# Altium schematic sheet audio_tas5720_amplifier.SchDoc
size A
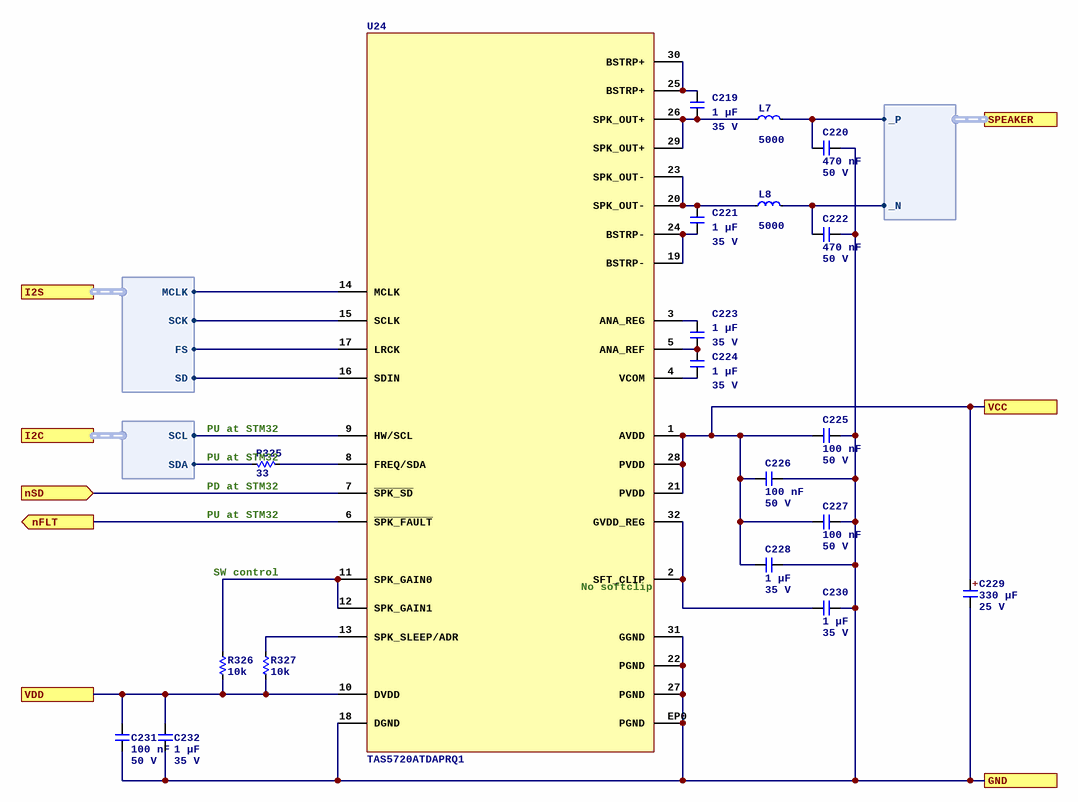
[diagram p0: audio_tas5720_amplifier.SchDoc]

## Parts
C219  Capacitance: 1 µF  Voltage Rating: 35 V  [C0603]  (hidden comment: GMK107AB7105KAHT)
C220  Capacitance: 470 nF  Voltage Rating: 50 V  [C0603]  (hidden comment: CC0603KRX7R9BB474)
C221  Capacitance: 1 µF  Voltage Rating: 35 V  [C0603]  (hidden comment: GMK107AB7105KAHT)
C222  Capacitance: 470 nF  Voltage Rating: 50 V  [C0603]  (hidden comment: CC0603KRX7R9BB474)
C223  Capacitance: 1 µF  Voltage Rating: 35 V  [C0603]  (hidden comment: GMK107AB7105KAHT)
C224  Capacitance: 1 µF  Voltage Rating: 35 V  [C0603]  (hidden comment: GMK107AB7105KAHT)
C225  Capacitance: 100 nF  Voltage Rating: 50 V  [C0402]  (hidden comment: CL05B104KB54PNC)
C226  Capacitance: 100 nF  Voltage Rating: 50 V  [C0402]  (hidden comment: CL05B104KB54PNC)
C227  Capacitance: 100 nF  Voltage Rating: 50 V  [C0402]  (hidden comment: CL05B104KB54PNC)
C228  Capacitance: 1 µF  Voltage Rating: 35 V  [C0603]  (hidden comment: GMK107AB7105KAHT)
C229  Capacitance: 330 µF  Voltage Rating: 25 V  [CAP_10001050_SMD]  (hidden comment: EEH-ZC1E331P)
C230  Capacitance: 1 µF  Voltage Rating: 35 V  [C0603]  (hidden comment: GMK107AB7105KAHT)
C231  Capacitance: 100 nF  Voltage Rating: 50 V  [C0402]  (hidden comment: CL05B104KB54PNC)
C232  Capacitance: 1 µF  Voltage Rating: 35 V  [C0603]  (hidden comment: GMK107AB7105KAHT)
L7  Current Rating (mA): 5000  [BOURNS_SRP5050FA]  (hidden comment: SRP5050FA-100M1)
L8  Current Rating (mA): 5000  [BOURNS_SRP5050FA]  (hidden comment: SRP5050FA-100M1)
R325  value 33  [R0402]  (hidden comment: 0402WGF330JTCE)
R326  value 10k  [R0402]  (hidden comment: 0402WGF1002TCE)
R327  value 10k  [R0402]  (hidden comment: 0402WGF1002TCE)
U24  TAS5720ATDAPRQ1  [TI_DAP0032B]

## Ports
GND, I2C (harness I2C), I2S (harness I2S), nFLT (out), nSD (in), SPEAKER (harness DIFF), VCC, VDD

## Harnesses
DIFF: _N, _P
I2S: MCLK, SCK, SD, FS
I2C: SCL, SDA

## Nets
GND: C220.2 C222.2 C225.2 C226.2 C227.2 C228.2 C229.2 C230.2 C231.2 C232.2 U24.18(DGND) U24.22(PGND) U24.27(PGND) U24.31(GGND) U24.EP0(PGND) ; port GND
nFLT: U24.6(~{SPK_FAULT}) ; port nFLT
nSD: U24.7(~{SPK_SD}) ; port nSD
VCC: C225.1 C226.1 C227.1 C228.1 C229.1 U24.1(AVDD) U24.21(PVDD) U24.28(PVDD) ; port VCC
VDD: C231.1 C232.1 R326.2 R327.2 U24.10(DVDD) ; port VDD
NetC219_1: C219.1 U24.25(BSTRP+) U24.30(BSTRP+)
NetC219_2: C219.2 L7.1 U24.26(SPK_OUT+) U24.29(SPK_OUT+)
NetC220_1: C220.1 L7.2 ; port SPEAKER._P
NetC221_1: C221.1 L8.1 U24.20(SPK_OUT-) U24.23(SPK_OUT-)
NetC221_2: C221.2 U24.19(BSTRP-) U24.24(BSTRP-)
NetC222_1: C222.1 L8.2 ; port SPEAKER._N
NetC223_1: C223.1 U24.3(ANA_REG)
NetC223_2: C223.2 C224.1 U24.5(ANA_REF)
NetC224_2: C224.2 U24.4(VCOM)
NetC230_1: C230.1 U24.2(SFT_CLIP) U24.32(GVDD_REG)
NetR325_1: R325.1 ; port I2C.SDA
NetR325_2: R325.2 U24.8(FREQ/SDA)
NetR326_1: R326.1 U24.11(SPK_GAIN0) U24.12(SPK_GAIN1)
NetR327_1: R327.1 U24.13(SPK_SLEEP/ADR)
NetU24_9: U24.9(HW/SCL) ; port I2C.SCL
NetU24_14: U24.14(MCLK) ; port I2S.MCLK
NetU24_15: U24.15(SCLK) ; port I2S.SCK
NetU24_16: U24.16(SDIN) ; port I2S.SD
NetU24_17: U24.17(LRCK) ; port I2S.FS

## Notes on the sheet
- PU at STM32
- (near R325) PU at STM32
- PD at STM32
- (near U24) SW control
- (near U24) No softclip
- (in symbol EEH-ZC1E331P) +

## Library data of the parts
C219 C221 C223 C224 C228 C230 C232 = GMK107AB7105KAHT: Manufacturer: Taiyo Yuden; Dielectric: X7R; ComponentLink1URL: https://datasheet.lcsc.com/lcsc/2304140030_Taiyo-Yuden-GMK107AB7105KAHT_C841050.pdf; ComponentLink1Description: Datasheet; Manufacturer Part Number: GMK107AB7105KAHT; Package: 0603; Supplier 2: LCSC; Supplier Part Number 2: C841050
C220 C222 = CC0603KRX7R9BB474: Manufacturer: YAGEO; Dielectric: X7R; ComponentLink1URL: https://wmsc.lcsc.com/wmsc/upload/file/pdf/v2/lcsc/2409272232_YAGEO-CC0603KRX7R9BB474_C513577.pdf; ComponentLink1Description: Datasheet; Manufacturer Part Number: CC0603KRX7R9BB474; Package: 0603; Supplier 2: LCSC; Supplier Part Number 2: C513577
C225-C227 C231 = CL05B104KB54PNC: Manufacturer: Samsung Electro-Mechanics; Dielectric: X7R; ComponentLink1URL: https://wmsc.lcsc.com/wmsc/upload/file/pdf/v2/lcsc/2304140030_Samsung-Electro-Mechanics-CL05B104KB54PNC_C307331.pdf; ComponentLink1Description: Datasheet; Manufacturer Part Number: CL05B104KB54PNC; Package: 0402; Supplier 2: LCSC; Supplier Part Number 2: C307331
C229 = EEH-ZC1E331P: SMD hybrid aluminum polymer capacitor, 330 µF, 25 V; Manufacturer: Panasonic Industry; Supplier 1: DigiKey; Supplier Part Number 1: P15459CT-ND; Manufacturer Part Number: EEH-ZC1E331P; Supplier 2: LCSC; Supplier Part Number 2: C178641; ComponentLink1Description: Datasheet; ComponentLink1URL: https://industrial.panasonic.com/cdbs/www-data/pdf/RDD0000/ABA0000C1234.pdf; Type: Aluminum Polymer; Supplier 3: Mouser; Supplier Part Number 3: 667-EEH-ZC1E331P
L7 L8 = SRP5050FA-100M1: 10 µH shielded power inductor; Manufacturer: BOURNS; DCR (mOhms): 43; Inductance (µH): 10; Manufacturer Part Number: SRP5050FA-100M1; Supplier 1: DigiKey; Supplier Part Number 1: 118-SRP5050FA-100M1CT-ND; Supplier 2: LCSC; Supplier Part Number 2: C3223883; ComponentLink1Description: Datasheet; ComponentLink1URL: https://www.bourns.com/docs/product-datasheets/srp5050fa.pdf; Supplier 3: Mouser; Supplier Part Number 3: 652-SRP5050FA-100M1
R325 = 0402WGF330JTCE: Manufacturer: UNI-ROYAL(Uniroyal Elec); Tolerance: 1%; Temperature Coefficient: ±100ppm/?; Power Rating (mW): 62.5; ComponentLink1Description: Datasheet; ComponentLink1URL: https://wmsc.lcsc.com/wmsc/upload/file/pdf/v2/lcsc/2205311900_UNI-ROYAL-Uniroyal-Elec-0402WGF330JTCE_C25105.pdf; Manufacturer Part Number: 0402WGF330JTCE; Package: 0402; Supplier 2: LCSC; Supplier Part Number 2: C25105
R326 R327 = 0402WGF1002TCE: Manufacturer: UNI-ROYAL(Uniroyal Elec); Power Rating (mW): 62.5; Tolerance: 1%; Temperature Coefficient: ±100ppm/?; Manufacturer Part Number: 0402WGF1002TCE; Package: 0402; Supplier 2: LCSC; Supplier Part Number 2: C25744; ComponentLink1Description: Datasheet; ComponentLink1URL: https://wmsc.lcsc.com/wmsc/upload/file/pdf/v2/lcsc/2206010100_UNI-ROYAL-Uniroyal-Elec-0402WGF1002TCE_C25744.pdf
U24 = TAS5720ATDAPRQ1: Amplifier IC 1-Channel (Mono) Class D 32-HTSSOP; Manufacturer: Texas Instruments; Supplier 1: DigiKey; Supplier Part Number 1: 296-51621-1-ND; Manufacturer Part Number: TAS5720ATDAPRQ1; Supplier Part Number 2: C2879310; ComponentLink1Description: Datasheet; ComponentLink1URL: https://www.ti.com/lit/ds/symlink/tas5720a-q1.pdf; Supplier 2: LCSC; Supplier 3: Mouser; Supplier Part Number 3: 595-TAS5720ATDAPRQ1